# Altium schematic sheet Core.SchDoc
size A3
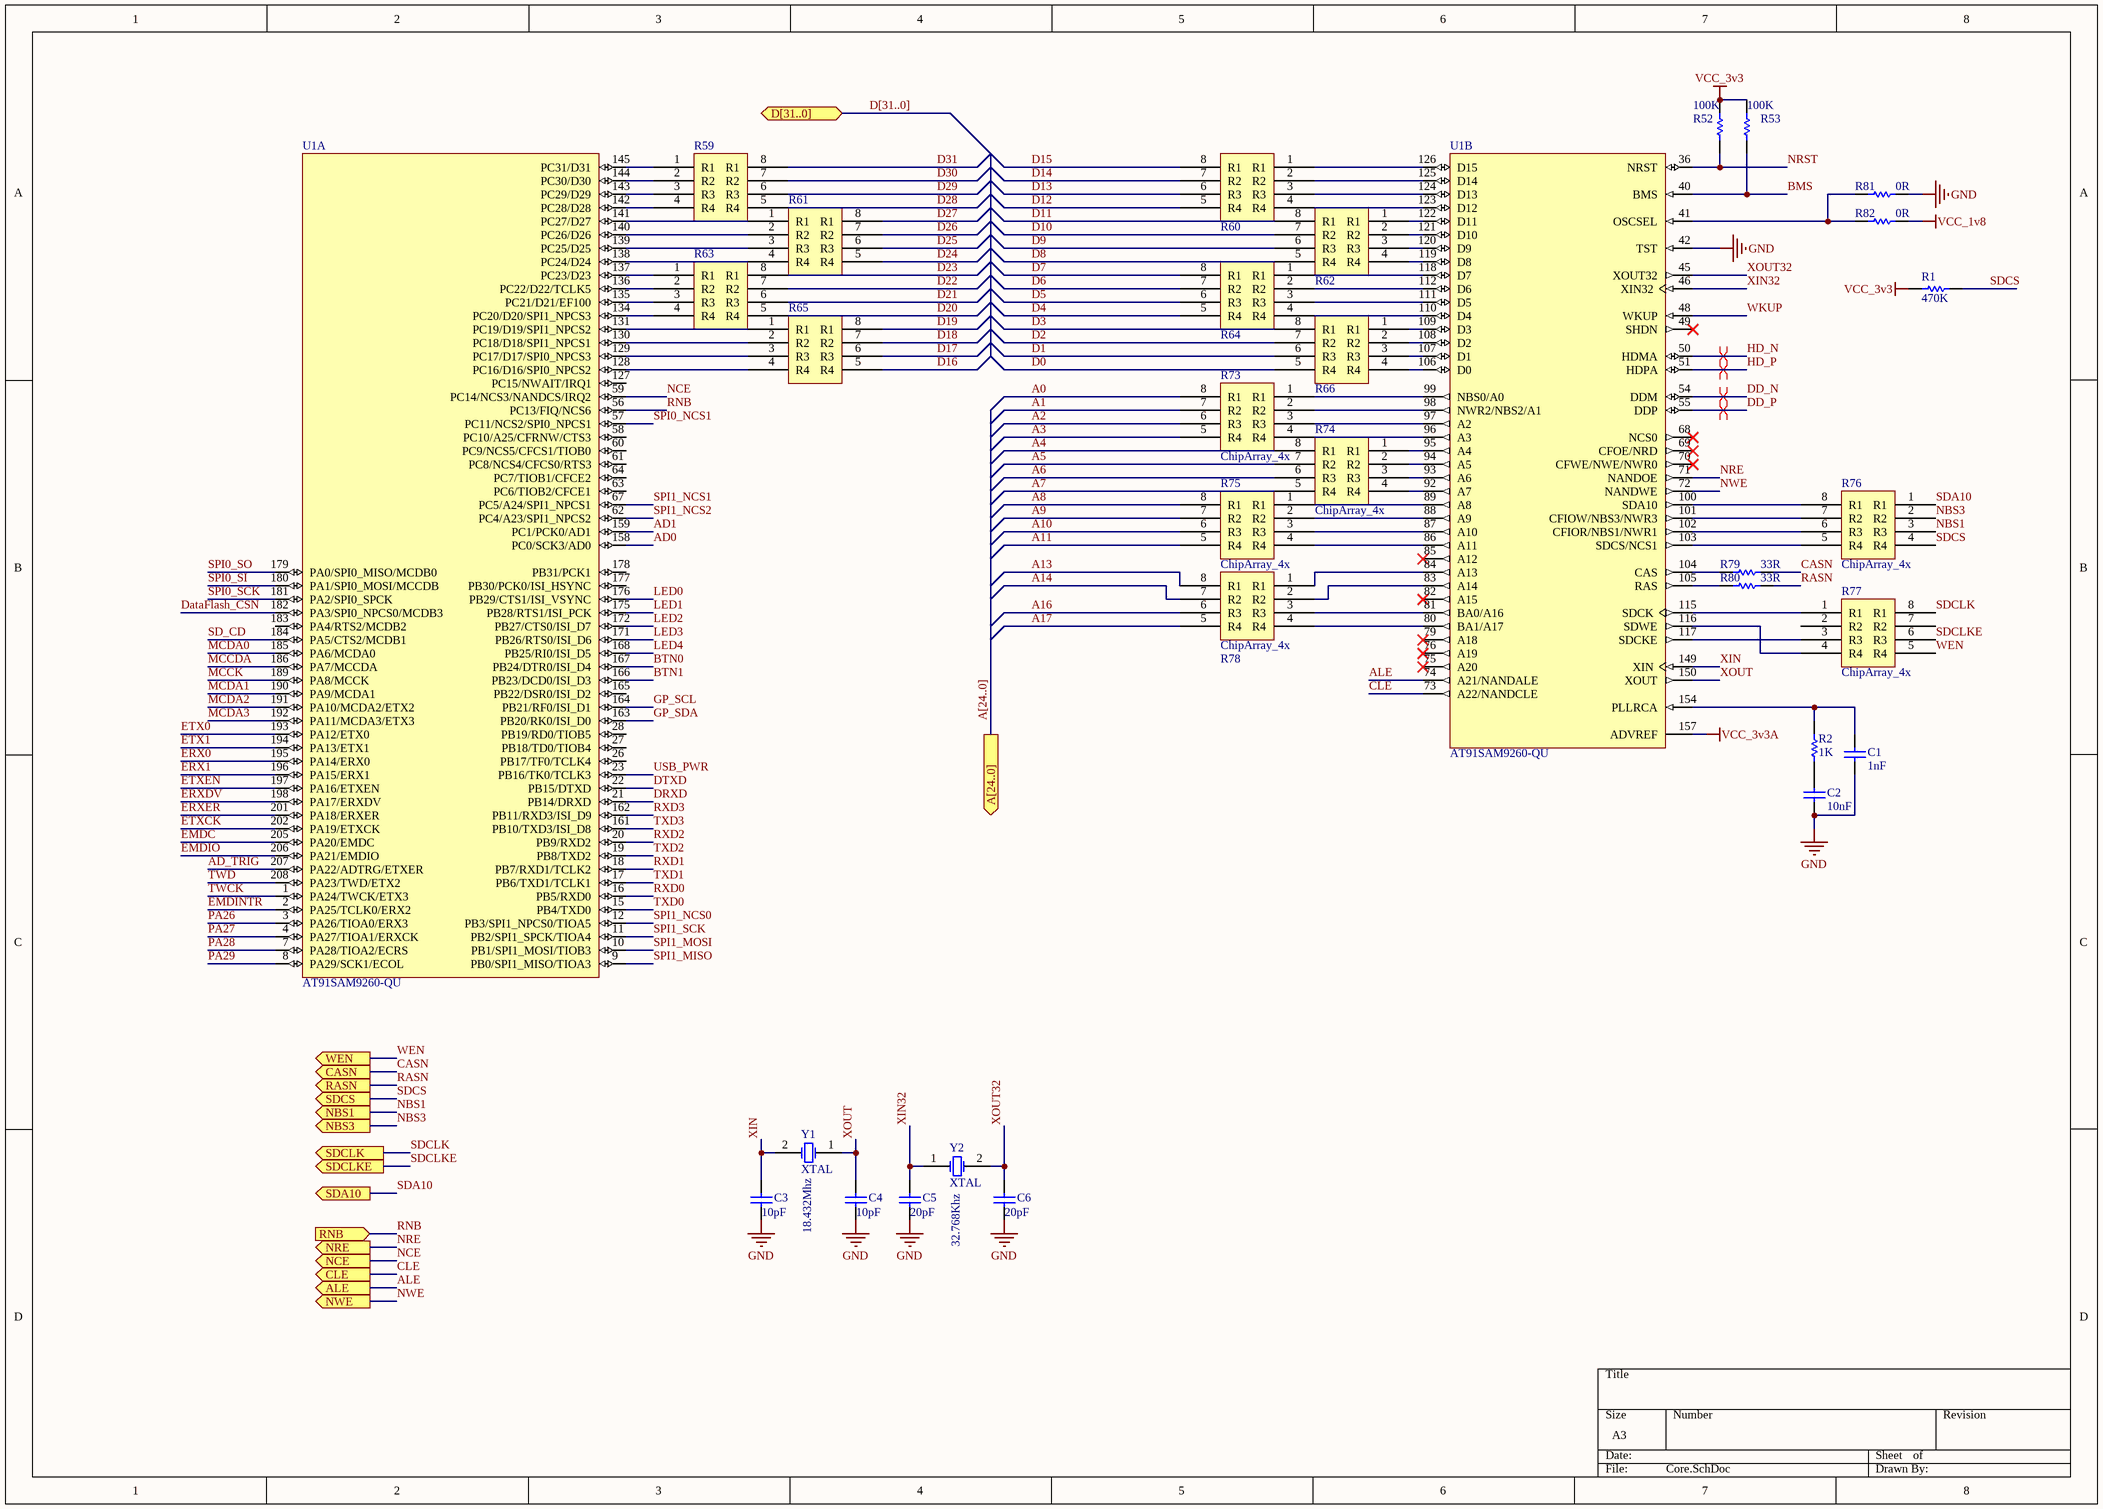
[diagram p0: Core.SchDoc]

## Parts
C1  value 1nF  [C0805]  (hidden comment: Cap)
C2  value 10nF  [C0805]  (hidden comment: Cap)
C3  value 10pF  [C0805]  (hidden comment: Cap)
C4  value 10pF  [C0805]  (hidden comment: Cap)
C5  value 20pF  [0603PKG]  (hidden comment: Cap)
C6  value 20pF  [0603PKG]  (hidden comment: Cap)
R1  value 470K  [C0805]  (hidden comment: Res Semi)
R2  value 1K  [C0805]  (hidden comment: Res Semi)
R52  value 100K  [C0805]  (hidden comment: Res1)
R53  value 100K  [C0805]  (hidden comment: Res1)
R59  ChipArray_4x  [CAC-50P205X105-8M]  (value not drawn)
R60  ChipArray_4x  [CAC-50P205X105-8M]  (value not drawn)
R61  ChipArray_4x  [CAC-50P205X105-8M]  (value not drawn)
R62  ChipArray_4x  [CAC-50P205X105-8M]  (value not drawn)
R63  ChipArray_4x  [CAC-50P205X105-8M]  (value not drawn)
R64  ChipArray_4x  [CAC-50P205X105-8M]  (value not drawn)
R65  ChipArray_4x  [CAC-50P205X105-8M]  (value not drawn)
R66  ChipArray_4x  [CAC-50P205X105-8M]  (value not drawn)
R73  ChipArray_4x  [CAC-50P205X105-8M]
R74  ChipArray_4x  [CAC-50P205X105-8M]
R75  ChipArray_4x  [CAC-50P205X105-8M]
R76  ChipArray_4x  [CAC-50P205X105-8M]
R77  ChipArray_4x  [CAC-50P205X105-8M]
R78  ChipArray_4x  [CAC-50P205X105-8M]
R79  value 33R  [C0805]  (hidden comment: Res Semi)
R80  value 33R  [C0805]  (hidden comment: Res Semi)
R81  value 0R  [0603PKG]  (hidden comment: Res Semi)
R82  value 0R  [0603PKG]  (hidden comment: Res Semi)
U1  AT91SAM9260-QU  [SQFP50P3122X3122X245-208N]  (parts A,B of 4)
Y1  XTAL  value 18.432Mhz  [SMD_Crystal]
Y2  XTAL  value 32.768Khz  [R38]

## Ports
A[24..0] (out), ALE (out), CASN (out), CLE (out), D[31..0], NBS1 (out), NBS3 (out), NCE (out), NRE (out), NWE (out), RASN (out), RNB (in), SDA10 (out), SDCLK (out), SDCLKE (out), SDCS (out), WEN (out)

## Nets
GND: C1.2 C2.1 C3.1 C4.1 C5.1 C6.1 R81.2 U1.42(TST)
VCC_1v8: R82.2
VCC_3v3: R1.1 R52.2 R53.2
VCC_3v3A: U1.157(ADVREF)
A0: R73.8(R1)
A1: R73.7(R2)
A2: R73.6(R3)
A3: R73.5(R4)
A4: R74.8(R1)
A5: R74.7(R2)
A6: R74.6(R3)
A7: R74.5(R4)
A8: R75.8(R1)
A9: R75.7(R2)
A10: R75.6(R3)
A11: R75.5(R4)
A13: R78.8(R1)
A14: R78.7(R2)
A16: R78.6(R3)
A17: R78.5(R4)
AD0: U1.158(PC0/SCK3/AD0)
AD1: U1.159(PC1/PCK0/AD1)
AD_TRIG: U1.207(PA22/ADTRG/ETXER)
ALE: U1.74(A21/NANDALE) ; port ALE
BMS: R53.1 U1.40(BMS)
BTN0: U1.167(PB24/DTR0/ISI_D4)
BTN1: U1.166(PB23/DCD0/ISI_D3)
CASN: R79.2 ; port CASN
CLE: U1.73(A22/NANDCLE) ; port CLE
D0: R66.5(R4)
D1: R66.6(R3)
D2: R66.7(R2)
D3: R66.8(R1)
D4: R64.5(R4)
D5: R64.6(R3)
D6: R64.7(R2)
D7: R64.8(R1)
D8: R62.5(R4)
D9: R62.6(R3)
D10: R62.7(R2)
D11: R62.8(R1)
D12: R60.5(R4)
D13: R60.6(R3)
D14: R60.7(R2)
D15: R60.8(R1)
D16: R65.5(R4)
D17: R65.6(R3)
D18: R65.7(R2)
D19: R65.8(R1)
D20: R63.5(R4)
D21: R63.6(R3)
D22: R63.7(R2)
D23: R63.8(R1)
D24: R61.5(R4)
D25: R61.6(R3)
D26: R61.7(R2)
D27: R61.8(R1)
D28: R59.5(R4)
D29: R59.6(R3)
D30: R59.7(R2)
D31: R59.8(R1)
DataFlash_CSN: U1.182(PA3/SPI0_NPCS0/MCDB3)
DD_N: U1.54(DDM)
DD_P: U1.55(DDP)
DRXD: U1.21(PB14/DRXD)
DTXD: U1.22(PB15/DTXD)
EMDC: U1.205(PA20/EMDC)
EMDINTR: U1.2(PA25/TCLK0/ERX2)
EMDIO: U1.206(PA21/EMDIO)
ERX0: U1.195(PA14/ERX0)
ERX1: U1.196(PA15/ERX1)
ERXDV: U1.198(PA17/ERXDV)
ERXER: U1.201(PA18/ERXER)
ETX0: U1.193(PA12/ETX0)
ETX1: U1.194(PA13/ETX1)
ETXCK: U1.202(PA19/ETXCK)
ETXEN: U1.197(PA16/ETXEN)
GP_SCL: U1.164(PB21/RF0/ISI_D1)
GP_SDA: U1.163(PB20/RK0/ISI_D0)
HD_N: U1.50(HDMA)
HD_P: U1.51(HDPA)
LED0: U1.176(PB29/CTS1/ISI_VSYNC)
LED1: U1.175(PB28/RTS1/ISI_PCK)
LED2: U1.172(PB27/CTS0/ISI_D7)
LED3: U1.171(PB26/RTS0/ISI_D6)
LED4: U1.168(PB25/RI0/ISI_D5)
MCCDA: U1.186(PA7/MCCDA)
MCCK: U1.189(PA8/MCCK)
MCDA0: U1.185(PA6/MCDA0)
MCDA1: U1.190(PA9/MCDA1)
MCDA2: U1.191(PA10/MCDA2/ETX2)
MCDA3: U1.192(PA11/MCDA3/ETX3)
NBS1: R76.3(R3) ; port NBS1
NBS3: R76.2(R2) ; port NBS3
NCE: U1.59(PC14/NCS3/NANDCS/IRQ2) ; port NCE
NRE: U1.71(NANDOE) ; port NRE
NRST: R52.1 U1.36(NRST)
NWE: U1.72(NANDWE) ; port NWE
PA26: U1.3(PA26/TIOA0/ERX3)
PA27: U1.4(PA27/TIOA1/ERXCK)
PA28: U1.7(PA28/TIOA2/ECRS)
PA29: U1.8(PA29/SCK1/ECOL)
RASN: R80.2 ; port RASN
RNB: U1.56(PC13/FIQ/NCS6) ; port RNB
RXD0: U1.16(PB5/RXD0)
RXD1: U1.18(PB7/RXD1/TCLK2)
RXD2: U1.20(PB9/RXD2)
RXD3: U1.162(PB11/RXD3/ISI_D9)
SD_CD: U1.184(PA5/CTS2/MCDB1)
SDA10: R76.1(R1) ; port SDA10
SDCLK: R77.8(R1) ; port SDCLK
SDCLKE: R77.6(R3) ; port SDCLKE
SDCS: R1.2 R76.4(R4) ; port SDCS
SPI0_NCS1: U1.57(PC11/NCS2/SPI0_NPCS1)
SPI0_SCK: U1.181(PA2/SPI0_SPCK)
SPI0_SI: U1.180(PA1/SPI0_MOSI/MCCDB)
SPI0_SO: U1.179(PA0/SPI0_MISO/MCDB0)
SPI1_MISO: U1.9(PB0/SPI1_MISO/TIOA3)
SPI1_MOSI: U1.10(PB1/SPI1_MOSI/TIOB3)
SPI1_NCS0: U1.12(PB3/SPI1_NPCS0/TIOA5)
SPI1_NCS1: U1.67(PC5/A24/SPI1_NPCS1)
SPI1_NCS2: U1.62(PC4/A23/SPI1_NPCS2)
SPI1_SCK: U1.11(PB2/SPI1_SPCK/TIOA4)
TWCK: U1.1(PA24/TWCK/ETX3)
TWD: U1.208(PA23/TWD/ETX2)
TXD0: U1.15(PB4/TXD0)
TXD1: U1.17(PB6/TXD1/TCLK1)
TXD2: U1.19(PB8/TXD2)
TXD3: U1.161(PB10/TXD3/ISI_D8)
USB_PWR: U1.23(PB16/TK0/TCLK3)
WEN: R77.5(R4) ; port WEN
WKUP: U1.48(WKUP)
XIN: C3.2 U1.149(XIN) Y1.2(OSC2)
XIN32: C5.2 U1.46(XIN32) Y2.1(OSC1)
XOUT: C4.2 U1.150(XOUT) Y1.1(OSC1)
XOUT32: C6.2 U1.45(XOUT32) Y2.2(OSC2)
NetC1_1: C1.1 R2.2 U1.154(PLLRCA)
NetC2_2: C2.2 R2.1
NetR59_1: R59.1(R1) U1.145(PC31/D31)
NetR59_2: R59.2(R2) U1.144(PC30/D30)
NetR59_3: R59.3(R3) U1.143(PC29/D29)
NetR59_4: R59.4(R4) U1.142(PC28/D28)
NetR60_1: R60.1(R1) U1.126(D15)
NetR60_2: R60.2(R2) U1.125(D14)
NetR60_3: R60.3(R3) U1.124(D13)
NetR60_4: R60.4(R4) U1.123(D12)
NetR61_1: R61.1(R1) U1.141(PC27/D27)
NetR61_2: R61.2(R2) U1.140(PC26/D26)
NetR61_3: R61.3(R3) U1.139(PC25/D25)
NetR61_4: R61.4(R4) U1.138(PC24/D24)
NetR62_1: R62.1(R1) U1.122(D11)
NetR62_2: R62.2(R2) U1.121(D10)
NetR62_3: R62.3(R3) U1.120(D9)
NetR62_4: R62.4(R4) U1.119(D8)
NetR63_1: R63.1(R1) U1.137(PC23/D23)
NetR63_2: R63.2(R2) U1.136(PC22/D22/TCLK5)
NetR63_3: R63.3(R3) U1.135(PC21/D21/EF100)
NetR63_4: R63.4(R4) U1.134(PC20/D20/SPI1_NPCS3)
NetR64_1: R64.1(R1) U1.118(D7)
NetR64_2: R64.2(R2) U1.112(D6)
NetR64_3: R64.3(R3) U1.111(D5)
NetR64_4: R64.4(R4) U1.110(D4)
NetR65_1: R65.1(R1) U1.131(PC19/D19/SPI1_NPCS2)
NetR65_2: R65.2(R2) U1.130(PC18/D18/SPI1_NPCS1)
NetR65_3: R65.3(R3) U1.129(PC17/D17/SPI0_NPCS3)
NetR65_4: R65.4(R4) U1.128(PC16/D16/SPI0_NPCS2)
NetR66_1: R66.1(R1) U1.109(D3)
NetR66_2: R66.2(R2) U1.108(D2)
NetR66_3: R66.3(R3) U1.107(D1)
NetR66_4: R66.4(R4) U1.106(D0)
NetR73_1: R73.1(R1) U1.99(NBS0/A0)
NetR73_2: R73.2(R2) U1.98(NWR2/NBS2/A1)
NetR73_3: R73.3(R3) U1.97(A2)
NetR73_4: R73.4(R4) U1.96(A3)
NetR74_1: R74.1(R1) U1.95(A4)
NetR74_2: R74.2(R2) U1.94(A5)
NetR74_3: R74.3(R3) U1.93(A6)
NetR74_4: R74.4(R4) U1.92(A7)
NetR75_1: R75.1(R1) U1.89(A8)
NetR75_2: R75.2(R2) U1.88(A9)
NetR75_3: R75.3(R3) U1.87(A10)
NetR75_4: R75.4(R4) U1.86(A11)
NetR76_5: R76.5(R4) U1.103(SDCS/NCS1)
NetR76_6: R76.6(R3) U1.102(CFIOR/NBS1/NWR1)
NetR76_7: R76.7(R2) U1.101(CFIOW/NBS3/NWR3)
NetR76_8: R76.8(R1) U1.100(SDA10)
NetR77_1: R77.1(R1) U1.115(SDCK)
NetR77_3: R77.3(R3) U1.117(SDCKE)
NetR77_4: R77.4(R4) U1.116(SDWE)
NetR78_1: R78.1(R1) U1.84(A13)
NetR78_2: R78.2(R2) U1.83(A14)
NetR78_3: R78.3(R3) U1.81(BA0/A16)
NetR78_4: R78.4(R4) U1.80(BA1/A17)
NetR79_1: R79.1 U1.104(CAS)
NetR80_1: R80.1 U1.105(RAS)
NetR81_1: R81.1 R82.1 U1.41(OSCSEL)

Not connected (* = marked no-connect by the designer): R77 2(R2) 7(R2); U1 26(PB17/TF0/TCLK4) 27(PB18/TD0/TIOB4) 28(PB19/RD0/TIOB5) 49(SHDN)* 58(PC10/A25/CFRNW/CTS3) 60(PC9/NCS5/CFCS1/TIOB0) 61(PC8/NCS4/CFCS0/RTS3) 63(PC6/TIOB2/CFCE1) 64(PC7/TIOB1/CFCE2) 68(NCS0)* 69(CFOE/NRD)* 70(CFWE/NWE/NWR0)* 75(A20)* 76(A19)* 79(A18)* 82(A15)* 85(A12)* 127(PC15/NWAIT/IRQ1) 165(PB22/DSR0/ISI_D2) 177(PB30/PCK0/ISI_HSYNC) 178(PB31/PCK1) 183(PA4/RTS2/MCDB2)

## Buses and harness runs
bus A[24..0] = port A[24..0]
bus D[31..0] = port D[31..0]

## Layout directives
differential pair: DD_N, DD_P, HD_N, HD_P

## Library data of the parts
C1-C6 = Cap: Capacitor; Published: 8-Jun-2000; LatestRevisionDate: 17-Jul-2002; LatestRevisionNote: Re-released for DXP Platform.; PackageReference: RAD-0.3; Publisher: Altium Limited; PackageDescription: Radial Cap, Thru-Hole; 2 Leads; 0.3 in Pin Spacing
R1 R2 R79-R82 = Res Semi: Semiconductor Resistor; Published: 8-Jun-2000; LatestRevisionDate: 17-Jul-2002; LatestRevisionNote: Re-released for DXP Platform.; PackageReference: AXIAL-0.5; Publisher: Altium Limited; PackageDescription: Axial Device, Thru-Hole; 2 Leads; 0.5 in Pin Spacing
R52 R53 = Res1: Resistor; Published: 8-Jun-2000; LatestRevisionDate: 17-Jul-2002; LatestRevisionNote: Re-released for DXP Platform.; PackageReference: AXIAL-0.3; Publisher: Altium Limited; PackageDescription: Axial Device, Thru-Hole; 2 Leads; 0.3 in Pin Spacing
U1 = AT91SAM9260-QU: AT91 ARM Thumb 32-bit Embedded MPU, 210MHz, 32KB ROM, 2x4KB SRAM, EBI, E-MAC, FS USB, 208-Pin PQFP, Industrial Grade (-40°C to 85°C), Pb-Free; DatasheetVersion: revJ, May-2011; PackageVersion: Jul-2005; PackageReference: QFP208; PackageDescription: 208-Pin Plastic Shrink Quad Flat Pack 0.5 mm Pitch; Code_JEDEC: MS-022; ComponentLink1Description: Manufacturer URL; ComponentLink1URL: http://www.atmel.com/; ComponentLink2Description: AT91SAM9260 Datasheet; ComponentLink2URL: http://www.atmel.com/dyn/resources/prod_documents/doc6221.pdf; ComponentLink3Description: AT91SAM9260 Summary; ComponentLink3URL: http://www.atmel.com/dyn/resources/prod_documents/6221s.pdf; ComponentLink4Description: ARM9E-S Reference Manual; ComponentLink4URL: http://www.atmel.com/dyn/resources/prod_documents/doc6178.pdf
Y1 Y2 = XTAL: Crystal Oscillator; Published: 8-Jun-2000; LatestRevisionDate: 17-Jul-2002; LatestRevisionNote: Re-released for DXP Platform.; PackageReference: R38; Publisher: Altium Limited; PackageDescription: Crystal, Thru-Hole; 2 Leads; Body 3.1 x 8.2 mm (Dia.xH)